# Altium schematic sheet KEY.SchDoc
size A
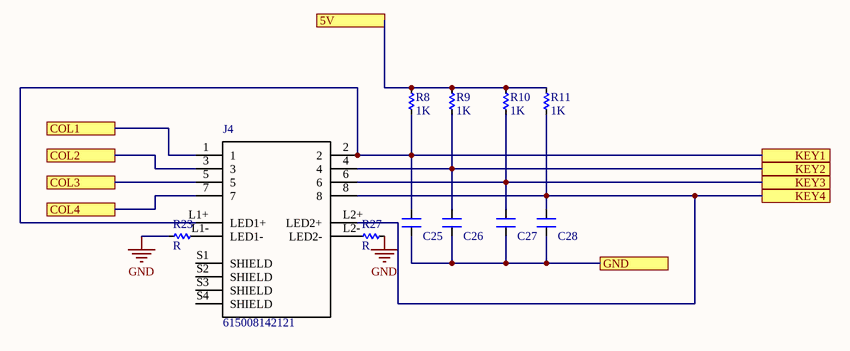
[diagram p0: KEY.SchDoc]

## Parts
C25  CN  [CN-SMD-0603_big]  (value not drawn)
C26  CN  [CN-SMD-0603_big]  (value not drawn)
C27  CN  [CN-SMD-0603_big]  (value not drawn)
C28  CN  [CN-SMD-0603_big]  (value not drawn)
J4  615008142121  [RJ45_8P8C]
R8  1K  [RES-SMD-0603_BIG]
R9  1K  [RES-SMD-0603_BIG]
R10  1K  [RES-SMD-0603_BIG]
R11  1K  [RES-SMD-0603_BIG]
R23  R  [RES-SMD-0603_BIG]
R27  R  [RES-SMD-0603_BIG]

## Ports
5V, COL1, COL2, COL3, COL4, GND, KEY1, KEY2, KEY3, KEY4

## Nets
GND: R23.2 R27.1
5V: R8.1 R9.1 R10.1 R11.1 ; port 5V
COL1: J4.1 ; port COL1
COL2: J4.3 ; port COL2
COL3: J4.5 ; port COL3
COL4: J4.7 ; port COL4
GND: C25.1 C26.1 C27.1 C28.1 ; port GND  [a separate net that carries the same name]
KEY1: C25.2 J4.2 J4.L1+(LED1+) R8.2 ; port KEY1
KEY2: C26.2 J4.4 R9.2 ; port KEY2
KEY3: C27.2 J4.6 R10.2 ; port KEY3
KEY4: C28.2 J4.8 J4.L2+(LED2+) R11.2 ; port KEY4
NetJ4_L1-: J4.L1-(LED1-) R23.1
NetJ4_L2-: J4.L2-(LED2-) R27.2

Not connected (* = marked no-connect by the designer): J4 S1(SHIELD) S2(SHIELD) S3(SHIELD) S4(SHIELD)

## Library data of the parts
C25-C28 = CN: Value: 33pF
J4 = RJ45_8P8C: Conn, Rj45 Jack, Shld, 1port, 8p8c, Cat5; MF: WÃ¼rth Elektronik; MP: 615008142121; Price: None; Availability: Unavailable; SnapEDA_Link: https://www.snapeda.com/parts/615008142121/W%C3%BCrth%20Elektronik/view-part/1118273/?ref=snap; Package: None; Value: *
R8-R11 = R